# Altium schematic sheet heat_control.SchDoc
size 420 x 297 mm; PageSetup: Record=PageOptions|CenterHorizontal=True|CenterVertical=True|PrintScale=0.94|XCorrection=1.00|YCorrection=1.00|PrintKind=1|BorderSize=5000000|LeftOffset=0|BottomOffset=0|Orientation=1|PaperLength=1000|PaperWidth=1000|Scale=100|PaperSource=7|PrintQuality=-4|MediaType=1|DitherType=10|PaperKind=A4|PrintScaleMode=1; DecimalNumber: Децимальный номер; HeadOfSector: Нач. сектора; MainDevice: Перв.примен.; Name: Наименование
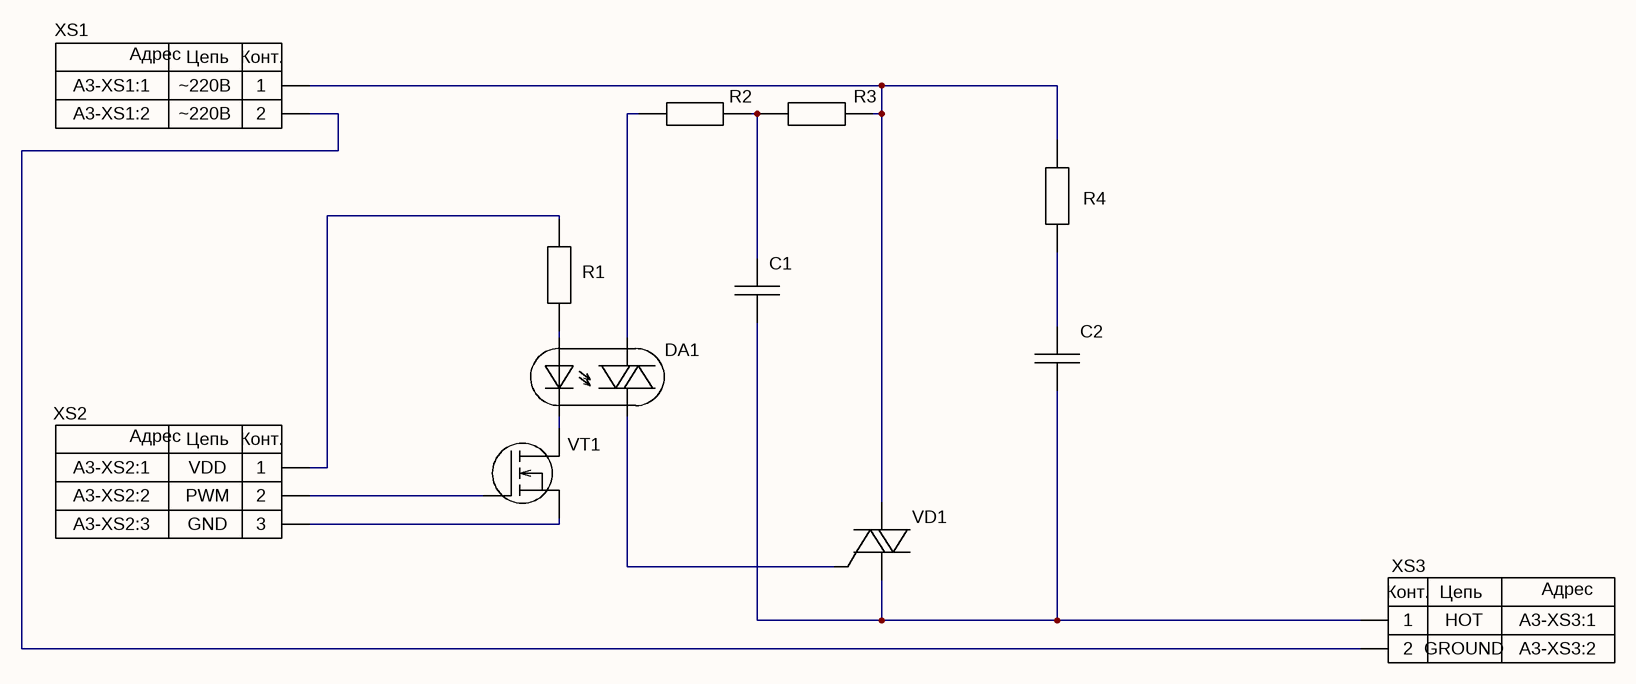
[diagram p0: heat_control.SchDoc]

## Parts
C1  10 нФ  [B32652]  (value not drawn)
C2  10 нФ  [B32652]  (value not drawn)
DA1  MOC3020M  [DIP762W48P254L889H508Q6]  (value not drawn)
R1  Res  (value not drawn)
R2  Res  (value not drawn)
R3  Res  (value not drawn)
R4  Res  (value not drawn)
VD1  BT137-600E  [TO220]  (value not drawn)
VT1  FDV303N  [SOT23]  (value not drawn)
XS1  circuit2: ~220В  =address2: A3-XS1:2  =address1: A3-XS1:1  [CON: WF-02]  (hidden comment: XS?)
XS2  circuit1: VDD  circuit2: PWM  circuit3: GND  =address1: A3-XS2:1  =address2: A3-XS2:2  =address3: A3-XS2:3  [CON: WF-03]  (hidden comment: XS?)
XS3  circuit2: GROUND  circuit1: HOT  =address2: A3-XS3:2  =address1: A3-XS3:1  [CON: WF-02]  (hidden comment: X2)

## Nets
NetC1_1: C1.1 C2.1 VD1.1 XS3.1
NetC1_2: C1.2 R2.2 R3.1
NetC2_2: C2.2 R4.2
NetDA1_1: DA1.1 R1.1
NetDA1_2: DA1.2 VT1.2
NetDA1_3: DA1.3 R2.1
NetDA1_4: DA1.4 VD1.3
NetR1_2: R1.2 XS2.1
NetR3_2: R3.2 R4.1 VD1.2 XS1.1
NetVT1_1: VT1.1 XS2.2
NetVT1_3: VT1.3 XS2.3
NetXS1_2: XS1.2 XS3.2

## Notes on the sheet
- Перв.примен.
- Справ.№
- Подп. и дата
- Инв.№ дубл.
- Взам.инв.№
- Подп.и дата
- Разраб.
- Изм.
- Лист
- № докум.
- Подп.
- Дата
- Лит.
- Масштаб
- Масса
- Т.контр.
- Пров.
- Листов
- Инв.№ подл.
- Утв.
- Н.контр.
- Нач.сект.
- Формат  A3
- (in symbol X2) Цепь; Конт.; Адрес
- (in symbol X3) Цепь; Конт.; Адрес

## Library data of the parts
C1 C2 = C_const
DA1 = opto_triak: pin to pad: 3>6
VD1 = triac
VT1 = n-mosfet: pin to pad: 2>3 3>2
XS1 = X2: circuit1: ~220В
XS2 = X3